# EAGLE schematic board (EAGLE 7.4.0)
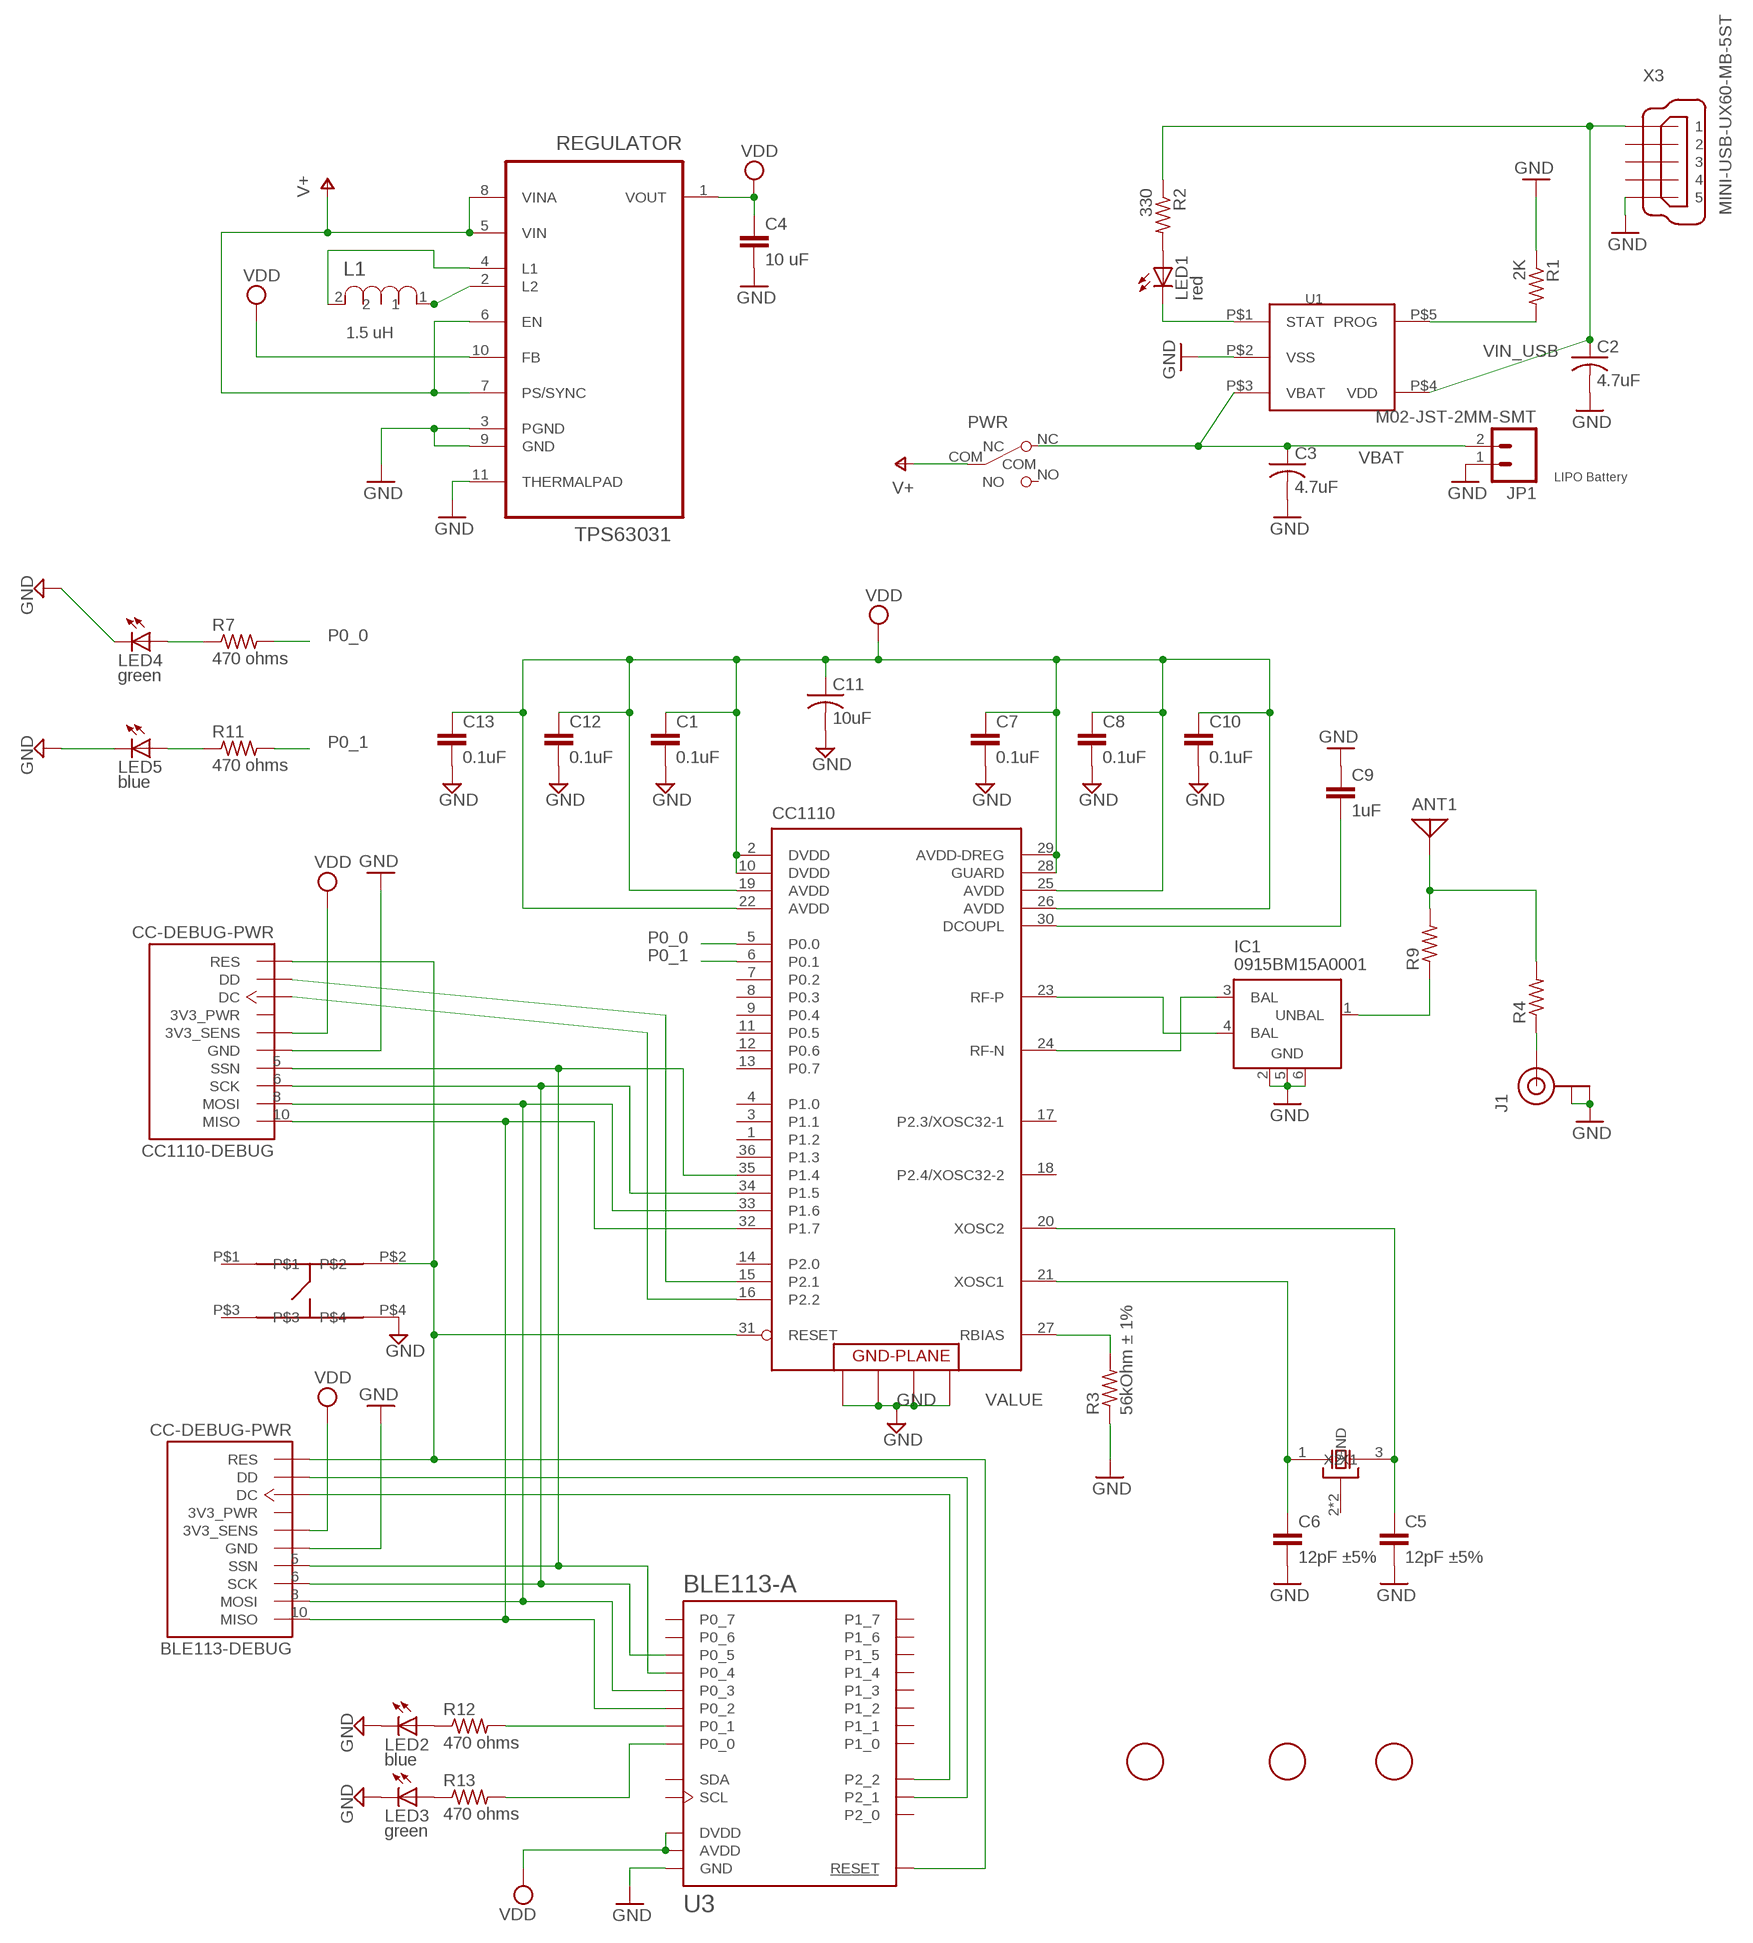
[diagram p0: schematic, sheet 1]

## Parts
ANT1  ANTENNA  [PAD-01]
BLE113-DEBUG  CC-DEBUG-PWR  [CC-P05]
C1  0.1uF  C-EUC0402  [C0402]
C2  4.7uF  C-USC0603K  [C0603K]
C3  4.7uF  C-USC0603K  [C0603K]
C4  10 uF  C-EUC0805K  [C0805K]
C5  12pF ±5%  C-EUC0402K  [C0402K]
C6  12pF ±5%  C-EUC0402K  [C0402K]
C7  0.1uF  C-EUC0402  [C0402]
C8  0.1uF  C-EUC0402  [C0402]
C9  1uF  C-EUC0402K  [C0402K]
C10  0.1uF  C-EUC0402  [C0402]
C11  10uF  C-USC0805K  [C0805K]
C12  0.1uF  C-EUC0402  [C0402]
C13  0.1uF  C-EUC0402  [C0402]
CC1110  CC1110  [QLP-36_UPDATE]
CC1110-DEBUG  CC-DEBUG-PWR  [CC-P05]
FID1  FIDUCIAL  [FIDUCIAL_1MM]
FID2  FIDUCIAL  [FIDUCIAL_1MM]
FID3  FIDUCIAL  [FIDUCIAL_1MM]
IC1  0915BM15A0001  [0915BM15A0001]
J1  U.FL  [U.FL]
JP1  M02-JST-2MM-SMT  [JST-2-SMD]
L1  1.5 uH  PM0603-R12J-RC  [INDC1610X12N]
LED1  red  LEDSML0603  [SML0603]
LED2  blue  LEDSML0603  [SML0603]
LED3  green  LEDSML0603  [SML0603]
LED4  green  LEDSML0603  [SML0603]
LED5  blue  LEDSML0603  [SML0603]
PWR  SW_SLIDE  [SLIDE_SWITCH_SMD]
R1  2K  R-US_R0402  [R0402]
R2  330  R-US_R0402  [R0402]
R3  56kOhm ± 1%  R-US_R0402  [R0402]
R4  R-US_R0402  [R0402]
R7  470 ohms  R-US_R0402  [R0402]
R9  R-US_R0402  [R0402]
R11  470 ohms  R-US_R0402  [R0402]
R12  470 ohms  R-US_R0402  [R0402]
R13  470 ohms  R-US_R0402  [R0402]
REGULATOR  TPS63031  [SON50P260X260X80-11N]
U1  MCP73831  [5PIN_SOT23]
U3  BLE113-A  [BLE113-A]
U$2  TACTILE_SWITCH  [PTS540]
X1  24MHz 8pF 10ppm -20C +70C  CTS_32X25_SMD  [CTS_32X25]
X3  MINI-USB-UX60-MB-5ST  [UX60-MB-5ST]

## Nets
DC: CC1110-DEBUG.3(DC) CC1110.16(P2.2)
DC_BLE: BLE113-DEBUG.3(DC) U3.P2_2
DD: CC1110-DEBUG.4(DD) CC1110.15(P2.1)
DD_BLE: BLE113-DEBUG.4(DD) U3.P2_1
GND: BLE113-DEBUG.1(GND) C1.2 C2.2 C3.2 C4.2 C5.2 C6.2 C7.2 C8.2 C9.1 C10.2 C11.2 C12.2 C13.2 CC1110-DEBUG.1(GND) CC1110.37(GND) CC1110.38(GND) CC1110.39(GND) CC1110.40(GND) IC1.2(GND) IC1.5(GND) IC1.6(GND) J1.P$1(GND) J1.P$2(GND) JP1.1 LED2.C LED3.C LED4.C LED5.C R1.1 R3.1 REGULATOR.3(PGND) REGULATOR.9(GND) REGULATOR.11(THERMALPAD) U1.P$2(VSS) U3.GND U3.GND@2(GND) U3.GND@3(GND) U3.GND@4(GND) U3.GND@5(GND) U3.GND@6(GND) U3.GND@7(GND) U3.GND@8(GND) U3.GND@9(GND) U3.GND@10(GND) U$2.P$4 X3.5
MISO: BLE113-DEBUG.10(MISO) CC1110-DEBUG.10(MISO) CC1110.32(P1.7) U3.P0_2
MOSI: BLE113-DEBUG.8(MOSI) CC1110-DEBUG.8(MOSI) CC1110.33(P1.6) U3.P0_3
N$1: L1.1 REGULATOR.2(L2)
N$2: LED1.C U1.P$1(STAT)
N$3: R1.2 U1.P$5(PROG)
N$4: LED1.A R2.2
N$5: CC1110.24(RF-N) IC1.3(BAL)
N$6: L1.2 REGULATOR.4(L1)
N$7: CC1110.23(RF-P) IC1.4(BAL)
N$9: J1.P$3(SIGNAL) R4.1
N$10: IC1.1(UNBAL) R9.1
N$12: ANT1.1 R4.2 R9.2
N$14: CC1110.27(RBIAS) R3.2
N$18: C9.2 CC1110.30(DCOUPL)
N$20: C6.1 CC1110.21(XOSC1) X1.1(X1)
N$21: C5.1 CC1110.20(XOSC2) X1.3(X2)
N$24: LED4.A R7.1
N$25: LED5.A R11.1
N$29: LED2.A R12.1
N$30: LED3.A R13.1
N$31: R12.2 U3.P0_1
N$32: R13.2 U3.P0_0
P0_0: CC1110.5(P0.0) R7.2
P0_1: CC1110.6(P0.1) R11.2
RESET: BLE113-DEBUG.7(RES) CC1110-DEBUG.7(RES) CC1110.31(RESET) U3.RESET U$2.P$2
SCK: BLE113-DEBUG.6(SCK) CC1110-DEBUG.6(SCK) CC1110.34(P1.5) U3.P0_5
SSN: BLE113-DEBUG.5(SSN) CC1110-DEBUG.5(SSN) CC1110.35(P1.4) U3.P0_4
V+: PWR.COM REGULATOR.5(VIN) REGULATOR.6(EN) REGULATOR.7(PS/SYNC) REGULATOR.8(VINA)
VBAT: C3.1 JP1.2 PWR.NC U1.P$3(VBAT)
VDD: BLE113-DEBUG.2(3V3_SENS) C1.1 C4.1 C7.1 C8.1 C10.1 C11.1 C12.1 C13.1 CC1110-DEBUG.2(3V3_SENS) CC1110.2(DVDD) CC1110.10(DVDD) CC1110.19(AVDD) CC1110.22(AVDD) CC1110.25(AVDD) CC1110.26(AVDD) CC1110.28(GUARD) CC1110.29(AVDD-DREG) REGULATOR.1(VOUT) REGULATOR.10(FB) U3.AVDD U3.DVDD
VIN_USB: C2.1 R2.1 U1.P$4(VDD) X3.1
Unconnected: BLE113-DEBUG.9(3V3_PWR) CC1110-DEBUG.9(3V3_PWR) CC1110.1(P1.2) CC1110.3(P1.1) CC1110.4(P1.0) CC1110.7(P0.2) CC1110.8(P0.3) CC1110.9(P0.4) CC1110.11(P0.5) CC1110.12(P0.6) CC1110.13(P0.7) CC1110.14(P2.0) CC1110.17(P2.3/XOSC32-1) CC1110.18(P2.4/XOSC32-2) CC1110.36(P1.3) PWR.NO U3.P0_6 U3.P0_7 U3.P1_0 U3.P1_1 U3.P1_2 U3.P1_3 U3.P1_4 U3.P1_5 U3.P1_6 U3.P1_7 U3.P2_0 U3.SCL U3.SDA U$2.P$1 U$2.P$3 X3.2 X3.3 X3.4

## Notes on the sheet
- LIPO Battery

## Power pins joined to a net without a drawn wire
GND: X1.2(GND) X1.4(GND)

## Library data of the parts
ANT1 = discrete:ANTENNA: Antenna
BLE113-DEBUG CC1110-DEBUG = parts:CC-DEBUG-PWR: CC debugger connection with various form factors. 2x5-pin 0.05" pitch header include Pin 9 (VDD) supply connection as separate pin. https://github.com/jrowberg/sf-oshw Last updated 2014-01-04 by Jeff Rowberg <jeff@rowberg.net>
C1 C4-C10 C12 C13 = rcl:C-EU: CAPACITOR
C2 C3 C11 = rcl:C-US: CAPACITOR, American symbol
CC1110 = board:CC1110: True System-on-Chip with Low Power RF Transceiver and 8051 MCU
FID1-FID3 = adafruit:FIDUCIAL: For use by pick and place machines to calibrate the vision/machine, 1mm By microbuilder.eu
IC1 = parts:0915BM15A0001: 915 MHz Impedance Matched Balun-Filter For TI CC11xx Chipset family Data sheet <http://www.johansontechnology.com/datasheets/chipset-specific/0915BM15A0001.pdf>
J1 = SparkFun-Connectors:U.FL: SMD antenna connector- WRL-09144; PROD_ID: CONN-09193
JP1 = SparkFun-Connectors:M02: Standard 2-pin 0.1" header. Use with - straight break away headers ( PRT-00116) - right angle break away headers (PRT-00553) - swiss pins (PRT-00743) - machine pins (PRT-00117) - female headers (PRT-00115) Molex polarized connector foot print use with: PRT-08233 with associated crimp pins and housings. 2.54_SCREWTERM for use with PRT-10571. 3.5mm Screw Terminal footprints for PRT-08084 5mm Screw Terminal footprints for use with PRT-08432; PROD_ID: CONN-08352
L1 = Bourns_By_element14_Batch_1:PM0603-R12J-RC: CHIP INDUCTOR, 120NH, 300MA, 5%, 1300MHZ; MPN: MLF1608A1R5KTD25; SUPPLIER: Mouser; TOLERANCE: ±5 %; VALUE: 120 nH
LED1-LED5 = led:LED: LED OSRAM: - CHIPLED LG R971, LG N971, LY N971, LG Q971, LY Q971, LO R971, LY R971 LH N974, LH R974 LS Q976, LO Q976, LY Q976 LO Q996 - Hyper CHIPLED LW Q18S LB Q993, LB Q99A, LB R99A - SideLED LS A670, LO A670, LY A670, LG A670, LP A670 LB A673, LV A673, LT A673, LW A673 LH A674 LY A675 LS A676, LA A676, LO A676, LY A676, LW A676 LS A679, LY A679, LG A679 - Hyper Micro SIDELED® LS Y876, LA Y876, LO Y876, LY Y876 LT Y87S - SmartLED LW L88C, LW L88S LB L89C, LB L89S, LG L890 LS L89K, LO L89K, LY L89K LS L896, LA L896, LO L896, LY L896 - TOPLED LS T670, LO T670, LY T670, LG T670, LP T670 LSG T670, LSP T670, LSY T670, LOP T670, LYG T670 LG T671, LOG T671, LSG T671 LB T673, LV T673, LT T673, LW T673 LH T674 LS T676, LA T676, LO T676, LY T676, LB T676, LH T676, LSB T676, LW T676 LB T67C, LV T67C, LT T67C, LS T67K, LO T67K, LY T67K, LW E67C LS E67B, LA E67B, LO E67B, LY E67B, LB E67C, LV E67C, LT E67C LW T67C LS T679, LY T679, LG T679 LS T770, LO T770, LY T770, LG T770, LP T770 LB T773, LV T773, LT T773, LW T773 LH T774 LS E675, LA E675, LY E675, LS T675 LS T776, LA T776, LO T776, LY T776, LB T776 LHGB T686 LT T68C, LB T68C - Hyper Mini TOPLED® LB M676 - Mini TOPLED Santana® LG M470 LS M47K, LO M47K, LY M47K Source: http://www.osram.convergy.de LUXEON: - LUMILED® LXK2-PW12-R00, LXK2-PW12-S00, LXK2-PW14-U00, LXK2-PW14-V00 LXK2-PM12-R00, LXK2-PM12-S00, LXK2-PM14-U00 LXK2-PE12-Q00, LXK2-PE12-R00, LXK2-PE12-S00, LXK2-PE14-T00, LXK2-PE14-U00 LXK2-PB12-K00, LXK2-PB12-L00, LXK2-PB12-M00, LXK2-PB14-N00, LXK2-PB14-P00, LXK2-PB14-Q00 LXK2-PR12-L00, LXK2-PR12-M00, LXK2-PR14-Q00, LXK2-PR14-R00 LXK2-PD12-Q00, LXK2-PD12-R00, LXK2-PD12-S00 LXK2-PH12-R00, LXK2-PH12-S00 LXK2-PL12-P00, LXK2-PL12-Q00, LXK2-PL12-R00 Source: www.luxeon.com KINGBRIGHT: KA-3528ASYC Source: www.kingbright.com
PWR = parts:SW_SLIDE
R1-R4 R7 R9 R11-R13 = rcl:R-US_: RESISTOR
REGULATOR = Texas Instruments_By_element14_Batch_1:TPS63031: HIGH EFFICIENCY SINGLE INDUCTOR BUCK-BOOST CONVERTER WITH 1-A SWITCHES; MPN: TPS63031; OC_FARNELL: 1686303; OC_NEWARK: 19P7478; PACKAGE: SON-10; SUPPLIER: Texas Instruments
U1 = parts:MCP73831: Digikey No:- __MCP73831T-2ACI/OTCT-ND__
U3 = sf-bluegiga:BLE113: Bluetooth Low Energy single-mode module - Bluetooth 4.0 (CC2541). BLE113-A variant has an on-module ceramic chip antenna. BLE113-A variant includes keepout/restrict area. Antenna edge of the module should be flush up against the edge of the PCB. See datasheet for variant layout details. The BLE113 is a Bluetooth Smart module targeted for small and low-power sensors and accessories. It integrates all features required for a Bluetooth Smart application, including Bluetooth radio, software stack, and GATT-based profiles. The BLE113 Bluetooth Smart module can also host end-user applications, which means no external micro controller is required in size or price constrained devices. Moreover, it has flexible hardware interfaces to connect to different peripherals and sensors and can be powered directly from a standard 3V coin cell battery or a pair of AAA batteries. In the lowest power sleep mode it merely consumes 500 nA and will wake up within a few hundred microseconds. The BLE113 Bluetooth Smart module conusmer approximately 30% less power and is smaller than the BLE112 Bluetooth Smart Module. http://www.bluegiga.com/en-US/products/bluetooth-4.0-modules/ble113-bluetooth--smart-module https://github.com/jrowberg/sf-oshw Last updated 2014-01-04 by Jeff Rowberg <jeff@rowberg.net>; ANTENNA: On-module ceramic chip antenna
U$2 = parts:TACTILE_SWITCH: Ultra Low Profile SMT Top Actuated PTS540 JM035 SMTR LFS Datasheet <http://www.mouser.com/ds/2/60/PTS540_9sept14-372441.pdf>
X1 = cts_crystal:CTS_32X25_SMD
X3 = con-hirose:MINI-USB-: MINI USB Connector Source: http://www.hirose.co.jp/cataloge_hp/e24000019.pdf; OC_FARNELL: unknown; OC_NEWARK: unknown